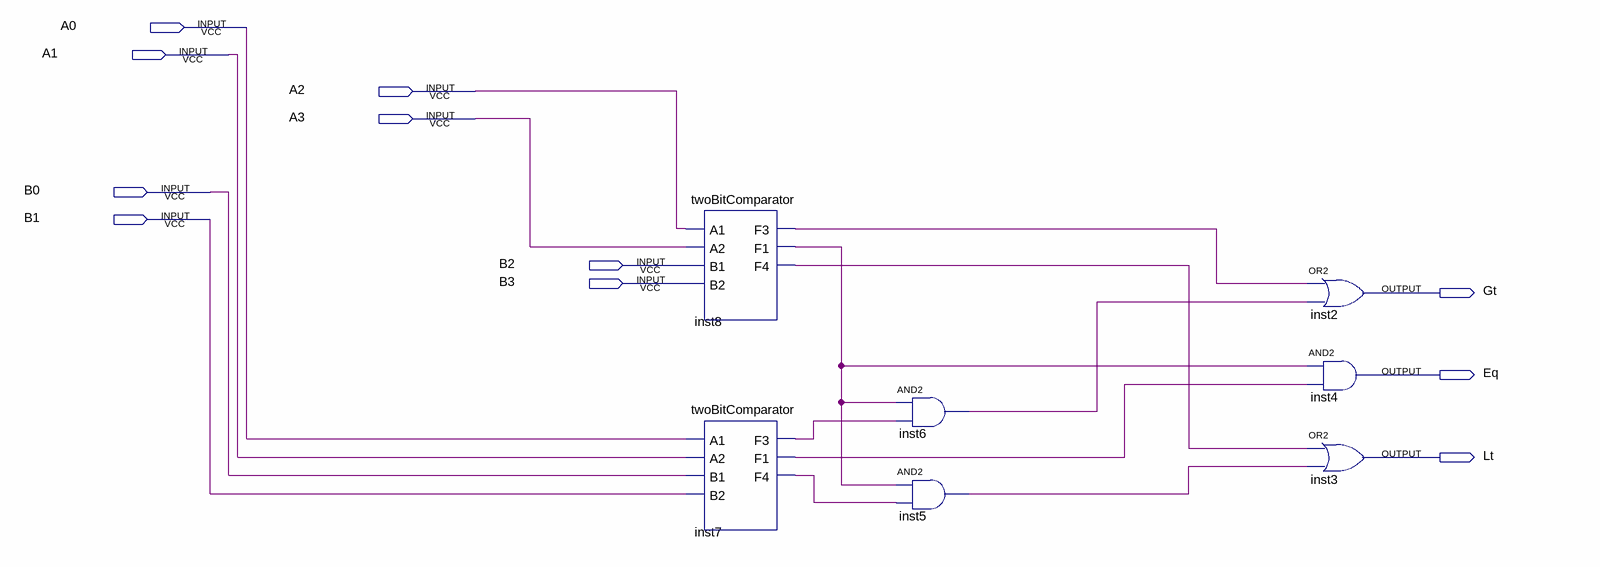
[diagram p0: schematic sheet]
// Quartus schematic newComparator.bdf as structural Verilog: 7 symbols, 11 pins
module newComparator (
  input  A0,
  input  A1,
  input  A2,
  input  A3,
  input  B0,
  input  B1,
  input  B2,
  input  B3,
  output Gt,
  output Eq,
  output Lt
);

  wire inst5_out, inst6_out, inst7_f1, inst7_f3, inst7_f4, inst8_f1, inst8_f3, inst8_f4;

  twoBitComparator inst8 (.A1(A2), .A2(A3), .B1(B2), .B2(B3), .F3(inst8_f3), .F1(inst8_f1), .F4(inst8_f4));
  twoBitComparator inst7 (.A1(A0), .A2(A1), .B1(B0), .B2(B1), .F3(inst7_f3), .F1(inst7_f1), .F4(inst7_f4));
  and inst6 (inst6_out, inst8_f1, inst7_f3);
  and inst5 (inst5_out, inst8_f1, inst7_f4);
  or inst2 (Gt, inst8_f3, inst6_out);
  and inst4 (Eq, inst8_f1, inst7_f1);
  or inst3 (Lt, inst8_f4, inst5_out);
endmodule
